# Altium schematic sheet ICs.SchDoc
size A; SheetNumber: 3; SheetTotal: 3
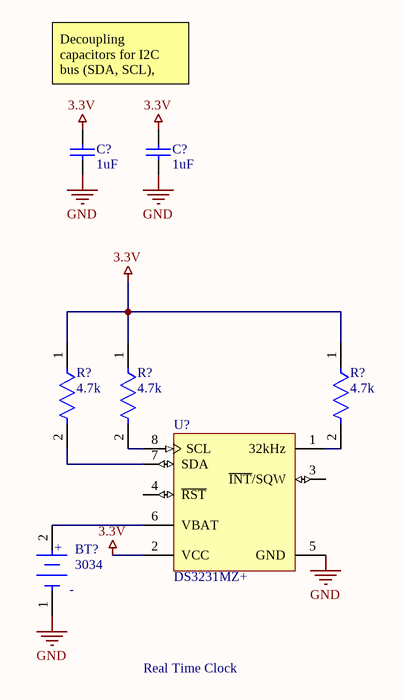
[diagram p0: ICs.SchDoc]

## Parts
(Parts that share a designator on the sheet are numbered #1, #2 ... from top to bottom, then left to right.)
BT?  3034  [FP-3034-MFG]
C?#1  1uF  [CAPC2013X140X50LL20T25]
C?#2  1uF  [CAPC2013X140X50LL20T25]
R?#1  4.7k  [FP-CRCW0805-e3-MFG]
R?#2  4.7k  [FP-CRCW0805-e3-MFG]
R?#3  4.7k  [FP-CRCW0805-e3-MFG]
U?  DS3231MZ+  [S8MK+1_N]

## Nets
3.3V: C?#1.2 C?#2.2 R?#1.1 R?#2.1 R?#3.1 U?.2(VCC)
GND: BT?.1(C) C?#1.1 C?#2.1 U?.5(GND)
NetBT?_2: BT?.2(A) U?.6(VBAT)
NetR?#1_2: R?#1.2 U?.7(SDA)
NetR?#2_2: R?#2.2 U?.8(SCL)
NetR?#3_2: R?#3.2 U?.1(32kHz)

Not connected (* = marked no-connect by the designer): U? 3(~{INT}/SQW) 4(~{RST})

## Notes on the sheet
- Decoupling capacitors for I2C bus (SDA, SCL), VCC for RTC
- Real Time Clock
- (in symbol CMP-19636-000006-1) +; -

## Library data of the parts
BT? = CMP-19636-000006-1: BATTERY RETAINER COIN 20MM SMD; Manufacturer: Keystone Electronics; Number Of Contacts: 2; Description: Coin Cell Battery Holders COIN CELL RETAINER; Height: 4.31mm; Device Class L1: Connectors; Device Class L3: unset; RoHS: TRUE; Automotive: No; Mouser Description: Coin Cell Battery Holders COIN CELL RETAINER; Contact Material: Nickel; Digikey Description: BATTERY RETAINER COIN 20MM SMD; Category: Batt; Package: 3034; ComponentLink2URL: https://www.keyelco.com/product-pdf.cfm?p=798; Manufacturer Part Number: 3034; Octopart: https://octopart.com/3034-keystone-27554462; ComponentLink2Description: Datasheet; Device Class L2: unset; Lead Free: Yes
C?#1 C?#2 = CMP-2007-03234-1: Part Number: C0805C105K3RACTU; Manufacturer: Kemet
R?#1-R?#3 = CMP-2001-03971-2: RES Thick Film, 4.87kΩ, 1%, 0.125W, 100ppm/°C, 0805; Voltage Rating: 150V; Resistance: 4.87kR; Power Rating: 125mW; Length: 2mm; Contact Plating: Tin; Min Operating Temperature: -55°C; Width: 0.049inch; Composition: Thick Film; Height: 0.45mm; Case Code (Imperial): 0805; Depth: 1.25mm; Tolerance: 1%; Number of Terminations: 2; Features: Automotive AEC-Q200; Number of Pins: 2; Case/Package: 0805; Termination: SMD/SMT; Military Standard: Not; Lead Free: Lead Free; Radiation Hardening: No; Case Code (Metric): 2012; Packaging: Tape and Reel; Max Power Dissipation: 125mW; Voltage Rating (DC): 150V; Package Quantity: 10; Max Operating Temperature: 155°C; Weight: 0.000194oz; Temperature Coefficient: 100ppm/°C
U? = CMP-0254-00001-2: +/-5ppm, MEMS based Real-Time Clock, I2C Interface, 8-Pin SO, -40 to 85 degC, Pb-Free; PackageVersion: revC, 2010; ComponentLink3Description: Package Specification; ComponentLink3URL: http://pdfserv.maxim-ic.com/package_dwgs/21-0041.PDF; PackageReference: S8MK+1; DatasheetVersion: Rev 3, Dec-2011; ComponentLink1Description: Manufacturer URL; ComponentLink2Description: Datasheet; PackageDescription: 8-Pin Small-Outline IC, Narrow (0.15in), 1.27 mm Pitch, SOIC (N), Pb-Free; Code_IPC: SOIC127P600-8; ComponentLink1URL: http://www.maxim-ic.com; Code_JEDEC: MS-012-AA; ComponentLink2URL: http://datasheets.maxim-ic.com/en/ds/DS3231M.pdf